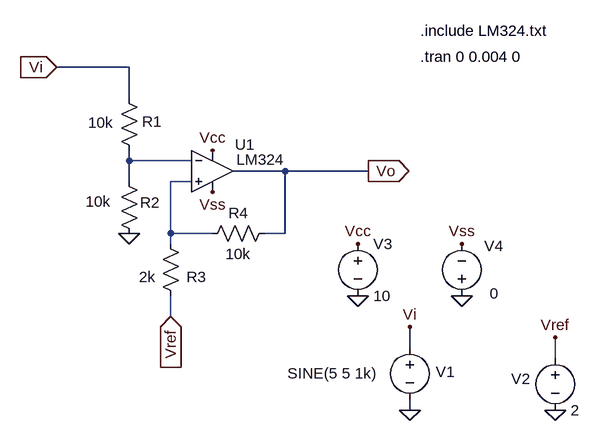
[diagram p0: schematic lab1C4.asc]
lab1C4.asc, the LTspice schematic file:
Version 4.1
SHEET 1 1156 708
WIRE 64 16 -48 16
WIRE 64 64 64 16
WIRE 64 160 64 144
WIRE 160 160 64 160
WIRE 304 176 224 176
WIRE 432 176 304 176
WIRE 64 192 64 160
WIRE 160 192 128 192
WIRE 128 272 128 192
WIRE 192 272 128 272
WIRE 304 272 304 176
WIRE 304 272 272 272
WIRE 128 288 128 272
WIRE 128 400 128 368
WIRE 496 448 496 416
WIRE 720 464 720 432
WIRE 496 544 496 528
FLAG 64 272 0
FLAG 496 544 0
FLAG 720 544 0
FLAG 416 368 0
FLAG 576 368 0
FLAG 576 288 Vss
FLAG 416 288 Vcc
FLAG 192 144 Vcc
FLAG 192 208 Vss
FLAG 432 176 Vo
IOPIN 432 176 Out
FLAG -48 16 Vi
IOPIN -48 16 In
FLAG 496 416 Vi
FLAG 720 432 Vref
FLAG 128 400 Vref
IOPIN 128 400 In
SYMBOL OpAmps\\opamp2 192 112 R0
WINDOW 0 35 23 Left 2
WINDOW 3 37 46 Left 2
SYMATTR InstName U1
SYMATTR Value LM324
SYMBOL res 48 48 R0
WINDOW 0 36 52 Left 2
WINDOW 3 -47 53 Left 2
SYMATTR InstName R1
SYMATTR Value 10k
SYMBOL res 48 176 R0
WINDOW 0 33 48 Left 2
WINDOW 3 -51 47 Left 2
SYMATTR InstName R2
SYMATTR Value 10k
SYMBOL res 112 272 R0
WINDOW 0 40 67 Left 2
WINDOW 3 -33 67 Left 2
SYMATTR InstName R3
SYMATTR Value 2k
SYMBOL res 288 256 R90
WINDOW 0 0 56 VBottom 2
WINDOW 3 32 56 VTop 2
SYMATTR InstName R4
SYMATTR Value 10k
SYMBOL voltage 496 432 R0
WINDOW 0 55 69 Bottom 2
WINDOW 3 -119 40 Top 2
WINDOW 123 0 0 Left 0
WINDOW 39 0 0 Left 0
SYMATTR InstName V1
SYMATTR Value SINE(5 5 1k)
SYMBOL voltage 720 448 R0
WINDOW 123 0 0 Left 0
WINDOW 39 0 0 Left 0
WINDOW 0 -68 48 Left 2
SYMATTR InstName V2
SYMATTR Value 2
SYMBOL voltage 416 272 R0
WINDOW 123 0 0 Left 0
WINDOW 39 0 0 Left 0
SYMATTR InstName V3
SYMATTR Value 10
SYMBOL voltage 576 384 R180
WINDOW 0 -64 93 Left 2
WINDOW 3 -57 20 Left 2
WINDOW 123 0 0 Left 0
WINDOW 39 0 0 Left 0
SYMATTR InstName V4
SYMATTR Value 0
TEXT 512 0 Left 2 !.tran 0 0.004 0
TEXT 512 -40 Left 2 !.include LM324.txt

The netlist it stands for:
* lab1C4.asc
X§U1 N002 N001 Vcc Vss Vo LM324  ; pins In+ In- V+ V- OUT
R1 Vi N001 10k
R2 N001 0 10k
R3 N002 Vref 2k
R4 Vo N002 10k
V1 Vi 0 SINE(5 5 1k)
V2 Vref 0 2
V3 Vcc 0 10
V4 0 Vss 0
.tran 0 0.004 0
.include LM324.txt
.backanno
.end